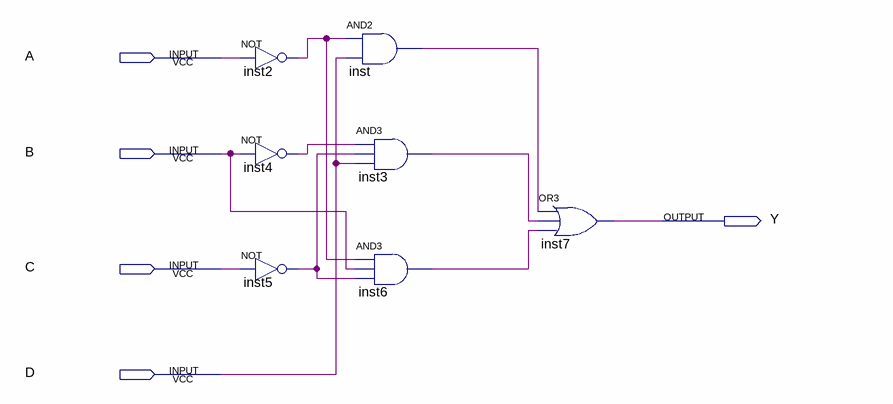
[diagram p0: schematic sheet]
// Quartus schematic circuit4.bdf as structural Verilog: 7 symbols, 5 pins
module circuit4 (
  input  A,
  input  B,
  input  C,
  input  D,
  output Y
);

  wire inst2_out, inst3_out, inst4_out, inst5_out, inst6_out, inst_out;

  not inst2 (inst2_out, A);
  not inst4 (inst4_out, B);
  not inst5 (inst5_out, C);
  and inst (inst_out, inst2_out, D);
  and inst3 (inst3_out, inst4_out, inst5_out, D);
  and inst6 (inst6_out, inst2_out, B, inst5_out);
  or inst7 (Y, inst_out, inst3_out, inst6_out);
endmodule
